# Altium schematic sheet 说明.SchDoc
size A4
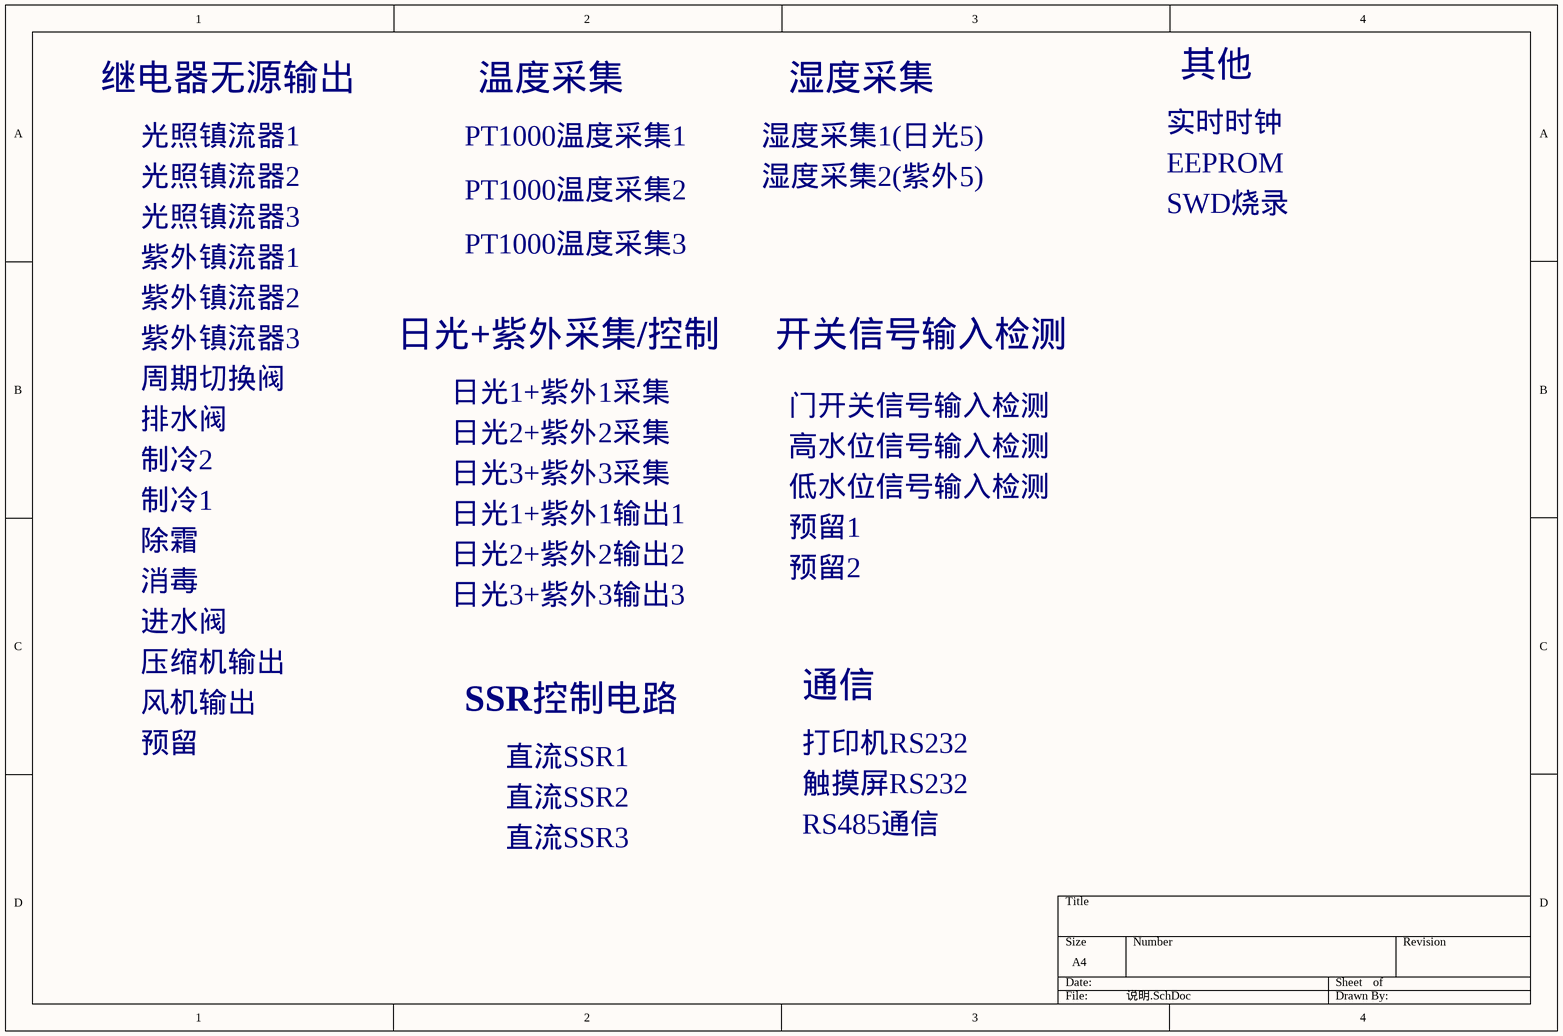
[diagram p0: 说明.SchDoc]

## Notes on the sheet
- 继电器无源输出
- 温度采集
- 湿度采集
- 其他
- 光照镇流器1
- PT1000温度采集1
- 湿度采集1(日光5)
- 实时时钟
- EEPROM
- 光照镇流器2
- 光照镇流器3
- PT1000温度采集2
- 湿度采集2(紫外5)
- SWD烧录
- 紫外镇流器1
- 紫外镇流器2
- PT1000温度采集3
- 紫外镇流器3
- 日光+紫外采集/控制
- 开关信号输入检测
- 排水阀
- 周期切换阀
- 日光1+紫外1采集
- 日光2+紫外2采集
- 门开关信号输入检测
- 制冷1
- 制冷2
- 日光3+紫外3采集
- 高水位信号输入检测
- 低水位信号输入检测
- 除霜
- 日光1+紫外1输出1
- 日光2+紫外2输出2
- 预留1
- 预留2
- 消毒
- 进水阀
- 日光3+紫外3输出3
- 风机输出
- 压缩机输出
- SSR控制电路
- 通信
- 预留
- 直流SSR1
- 打印机RS232
- 直流SSR2
- 直流SSR3
- 触摸屏RS232
- RS485通信